# EAGLE schematic chromatic_drum_gate_sync_v001 (EAGLE 8.0.0)
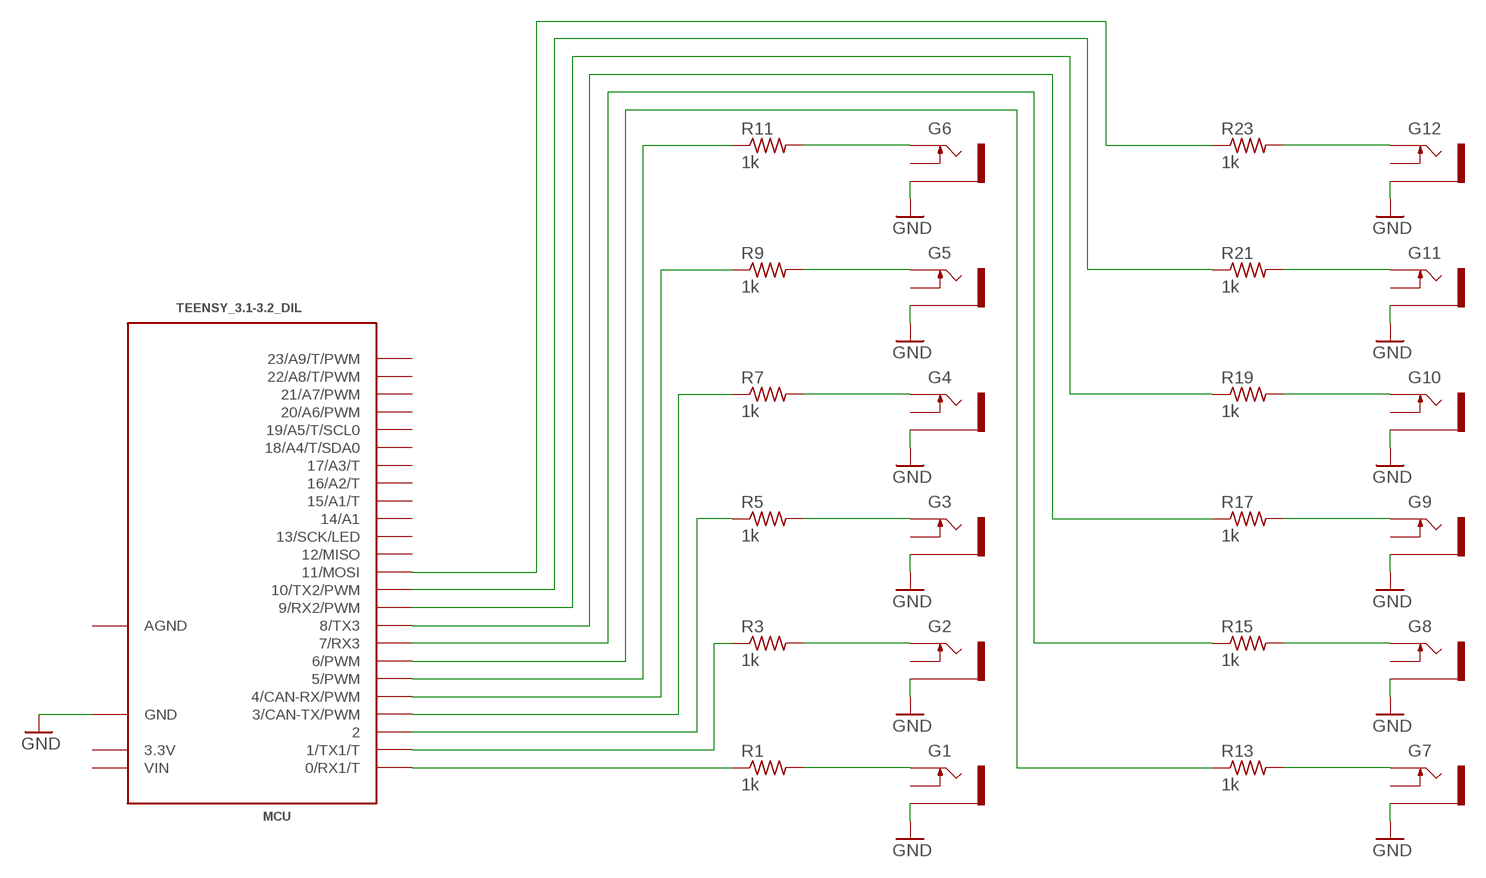
[diagram p0: schematic, sheet 1]

## Parts
G1  THONKICONNNEW  [WQP-PJ301M-12_JACK]
G2  THONKICONNNEW  [WQP-PJ301M-12_JACK]
G3  THONKICONNNEW  [WQP-PJ301M-12_JACK]
G4  THONKICONNNEW  [WQP-PJ301M-12_JACK]
G5  THONKICONNNEW  [WQP-PJ301M-12_JACK]
G6  THONKICONNNEW  [WQP-PJ301M-12_JACK]
G7  THONKICONNNEW  [WQP-PJ301M-12_JACK]
G8  THONKICONNNEW  [WQP-PJ301M-12_JACK]
G9  THONKICONNNEW  [WQP-PJ301M-12_JACK]
G10  THONKICONNNEW  [WQP-PJ301M-12_JACK]
G11  THONKICONNNEW  [WQP-PJ301M-12_JACK]
G12  THONKICONNNEW  [WQP-PJ301M-12_JACK]
MCU  TEENSY_3.1-3.2_DIL  [TEENSY_3.0-3.2&LC_DIL]
R1  1k  R-US_0207/7  [0207/7]
R3  1k  R-US_0207/7  [0207/7]
R5  1k  R-US_0207/7  [0207/7]
R7  1k  R-US_0207/7  [0207/7]
R9  1k  R-US_0207/7  [0207/7]
R11  1k  R-US_0207/7  [0207/7]
R13  1k  R-US_0207/7  [0207/7]
R15  1k  R-US_0207/7  [0207/7]
R17  1k  R-US_0207/7  [0207/7]
R19  1k  R-US_0207/7  [0207/7]
R21  1k  R-US_0207/7  [0207/7]
R23  1k  R-US_0207/7  [0207/7]

## Nets
GND: G1.P$3_SLEEVE(SLEEVE) G2.P$3_SLEEVE(SLEEVE) G3.P$3_SLEEVE(SLEEVE) G4.P$3_SLEEVE(SLEEVE) G5.P$3_SLEEVE(SLEEVE) G6.P$3_SLEEVE(SLEEVE) G7.P$3_SLEEVE(SLEEVE) G8.P$3_SLEEVE(SLEEVE) G9.P$3_SLEEVE(SLEEVE) G10.P$3_SLEEVE(SLEEVE) G11.P$3_SLEEVE(SLEEVE) G12.P$3_SLEEVE(SLEEVE) MCU.GND
N$1: G1.P$1_TIP(TIP) R1.2
N$2: G2.P$1_TIP(TIP) R3.2
N$3: MCU.1(1/TX1/T) R3.1
N$4: MCU.0(0/RX1/T) R1.1
N$7: G3.P$1_TIP(TIP) R5.2
N$8: MCU.2 R5.1
N$10: G4.P$1_TIP(TIP) R7.2
N$11: MCU.3(3/CAN-TX/PWM) R7.1
N$13: G5.P$1_TIP(TIP) R9.2
N$14: MCU.4(4/CAN-RX/PWM) R9.1
N$16: G6.P$1_TIP(TIP) R11.2
N$17: MCU.5(5/PWM) R11.1
N$19: G7.P$1_TIP(TIP) R13.2
N$20: MCU.6(6/PWM) R13.1
N$22: G8.P$1_TIP(TIP) R15.2
N$23: MCU.7(7/RX3) R15.1
N$25: G9.P$1_TIP(TIP) R17.2
N$26: MCU.8(8/TX3) R17.1
N$28: G10.P$1_TIP(TIP) R19.2
N$29: MCU.9(9/RX2/PWM) R19.1
N$31: G11.P$1_TIP(TIP) R21.2
N$32: MCU.10(10/TX2/PWM) R21.1
N$34: G12.P$1_TIP(TIP) R23.2
N$35: MCU.11(11/MOSI) R23.1
Unconnected: G1.P$2_SWITCH(SWITCH) G2.P$2_SWITCH(SWITCH) G3.P$2_SWITCH(SWITCH) G4.P$2_SWITCH(SWITCH) G5.P$2_SWITCH(SWITCH) G6.P$2_SWITCH(SWITCH) G7.P$2_SWITCH(SWITCH) G8.P$2_SWITCH(SWITCH) G9.P$2_SWITCH(SWITCH) G10.P$2_SWITCH(SWITCH) G11.P$2_SWITCH(SWITCH) G12.P$2_SWITCH(SWITCH) MCU.12(12/MISO) MCU.13(13/SCK/LED) MCU.14/A0(14/A1) MCU.15/A1(15/A1/T) MCU.16/A2(16/A2/T) MCU.17/A3(17/A3/T) MCU.18/A4(18/A4/T/SDA0) MCU.19/A5(19/A5/T/SCL0) MCU.20/A6(20/A6/PWM) MCU.21/A7(21/A7/PWM) MCU.22/A8(22/A8/T/PWM) MCU.23/A9(23/A9/T/PWM)

## Power pins joined to a net without a drawn wire
3.3V: MCU.3.3V
AGND: MCU.AGND
VIN: MCU.VIN

## Library data of the parts
G1-G12 = MusicThingModular:THONKICONN: 3.5mm socket for Eurorack modular synths
MCU = Teensy_3_and_LC_Series_Boards_v1.4:TEENSY_3.1-3.2_DIL: Teensy 3.1 or 3.2 in a DIL Layout.
R1 R3 R5 R7 R9 R11 R13 R15 R17 R19 R21 R23 = rcl:R-US_: RESISTOR, American symbol